# Altium schematic sheet TOP.SchDoc: =DocumentName
size A4; Organization: Queen's Formula SAE; Address1: 130 Stuart St, Kingston; Address2: Ontario; Address3: Canada; Address4: K7L 2V9; DocumentNumber: 1; Revision: 0; SheetNumber: 1; SheetTotal: 1
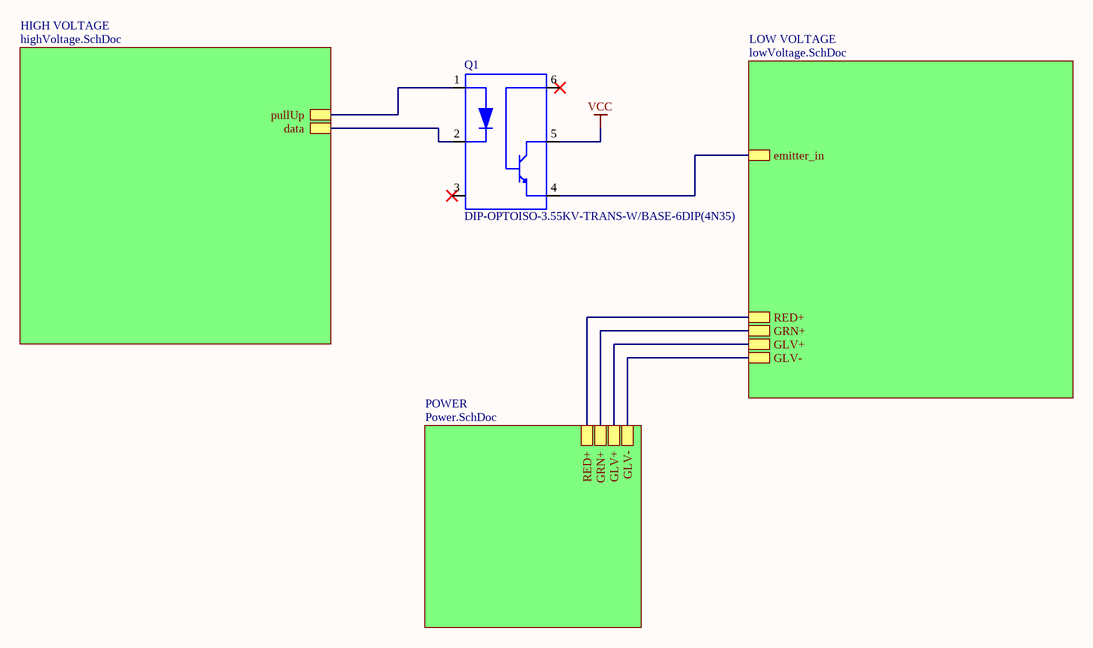
[diagram p0: TOP.SchDoc]

## Parts
Q1  DIP-OPTOISO-3.55KV-TRANS-W/BASE-6DIP(4N35)  [DIP6-2.54-7.3X6.5MM]

## Sub-sheets
HIGH VOLTAGE = highVoltage.SchDoc: pullUp, data
LOW VOLTAGE = lowVoltage.SchDoc: GLV-, GLV+, GRN+, RED+, emitter_in
POWER = Power.SchDoc: GLV-, GLV+, GRN+, RED+

## Nets
VCC: Q1.5(COLLECTOR)
NetQ1_1: Q1.1(ANODE) ; sheet HIGH VOLTAGE/pullUp
NetQ1_2: Q1.2(CATHODE) ; sheet HIGH VOLTAGE/data
NetQ1_4: Q1.4(EMITER) ; sheet LOW VOLTAGE/emitter_in
(unnamed): sheet POWER/GLV-, sheet LOW VOLTAGE/GLV-
(unnamed): sheet POWER/GLV+, sheet LOW VOLTAGE/GLV+
(unnamed): sheet POWER/GRN+, sheet LOW VOLTAGE/GRN+
(unnamed): sheet POWER/RED+, sheet LOW VOLTAGE/RED+

Not connected (* = marked no-connect by the designer): Q1 3(NC)* 6(BASE)*

## Notes on the sheet
- Title
- Size:
- Date:
- A4
- Number:
- Time:
- Revision:
- Sheet
- of
- File:

## Library data of the parts
Q1 = DIP-OPTOISO-3.55KV-TRANS-W/BASE-6DIP(4N35): Optoisolator Transistor with Base Output 5000Vrms 1 Channel 6-DIP; MF: Vishay; Purchase-URL: https://pricing.snapeda.com/search/part/4N35/?ref=eda; Price: None; SnapEDA_Link: https://www.snapeda.com/parts/4N35/Vishay%20Semiconductor%20Opto%20Division/view-part/579099/?ref=snap; MP: 4N35; Availability: Good; Value: *; Check_prices: https://www.snapeda.com/parts/4N35/Vishay%20Semiconductor%20Opto%20Division/view-part/579099/?ref=eda; Package: DIP-6 Texas Instruments